# Altium project A3010_IDE.PrjPcb
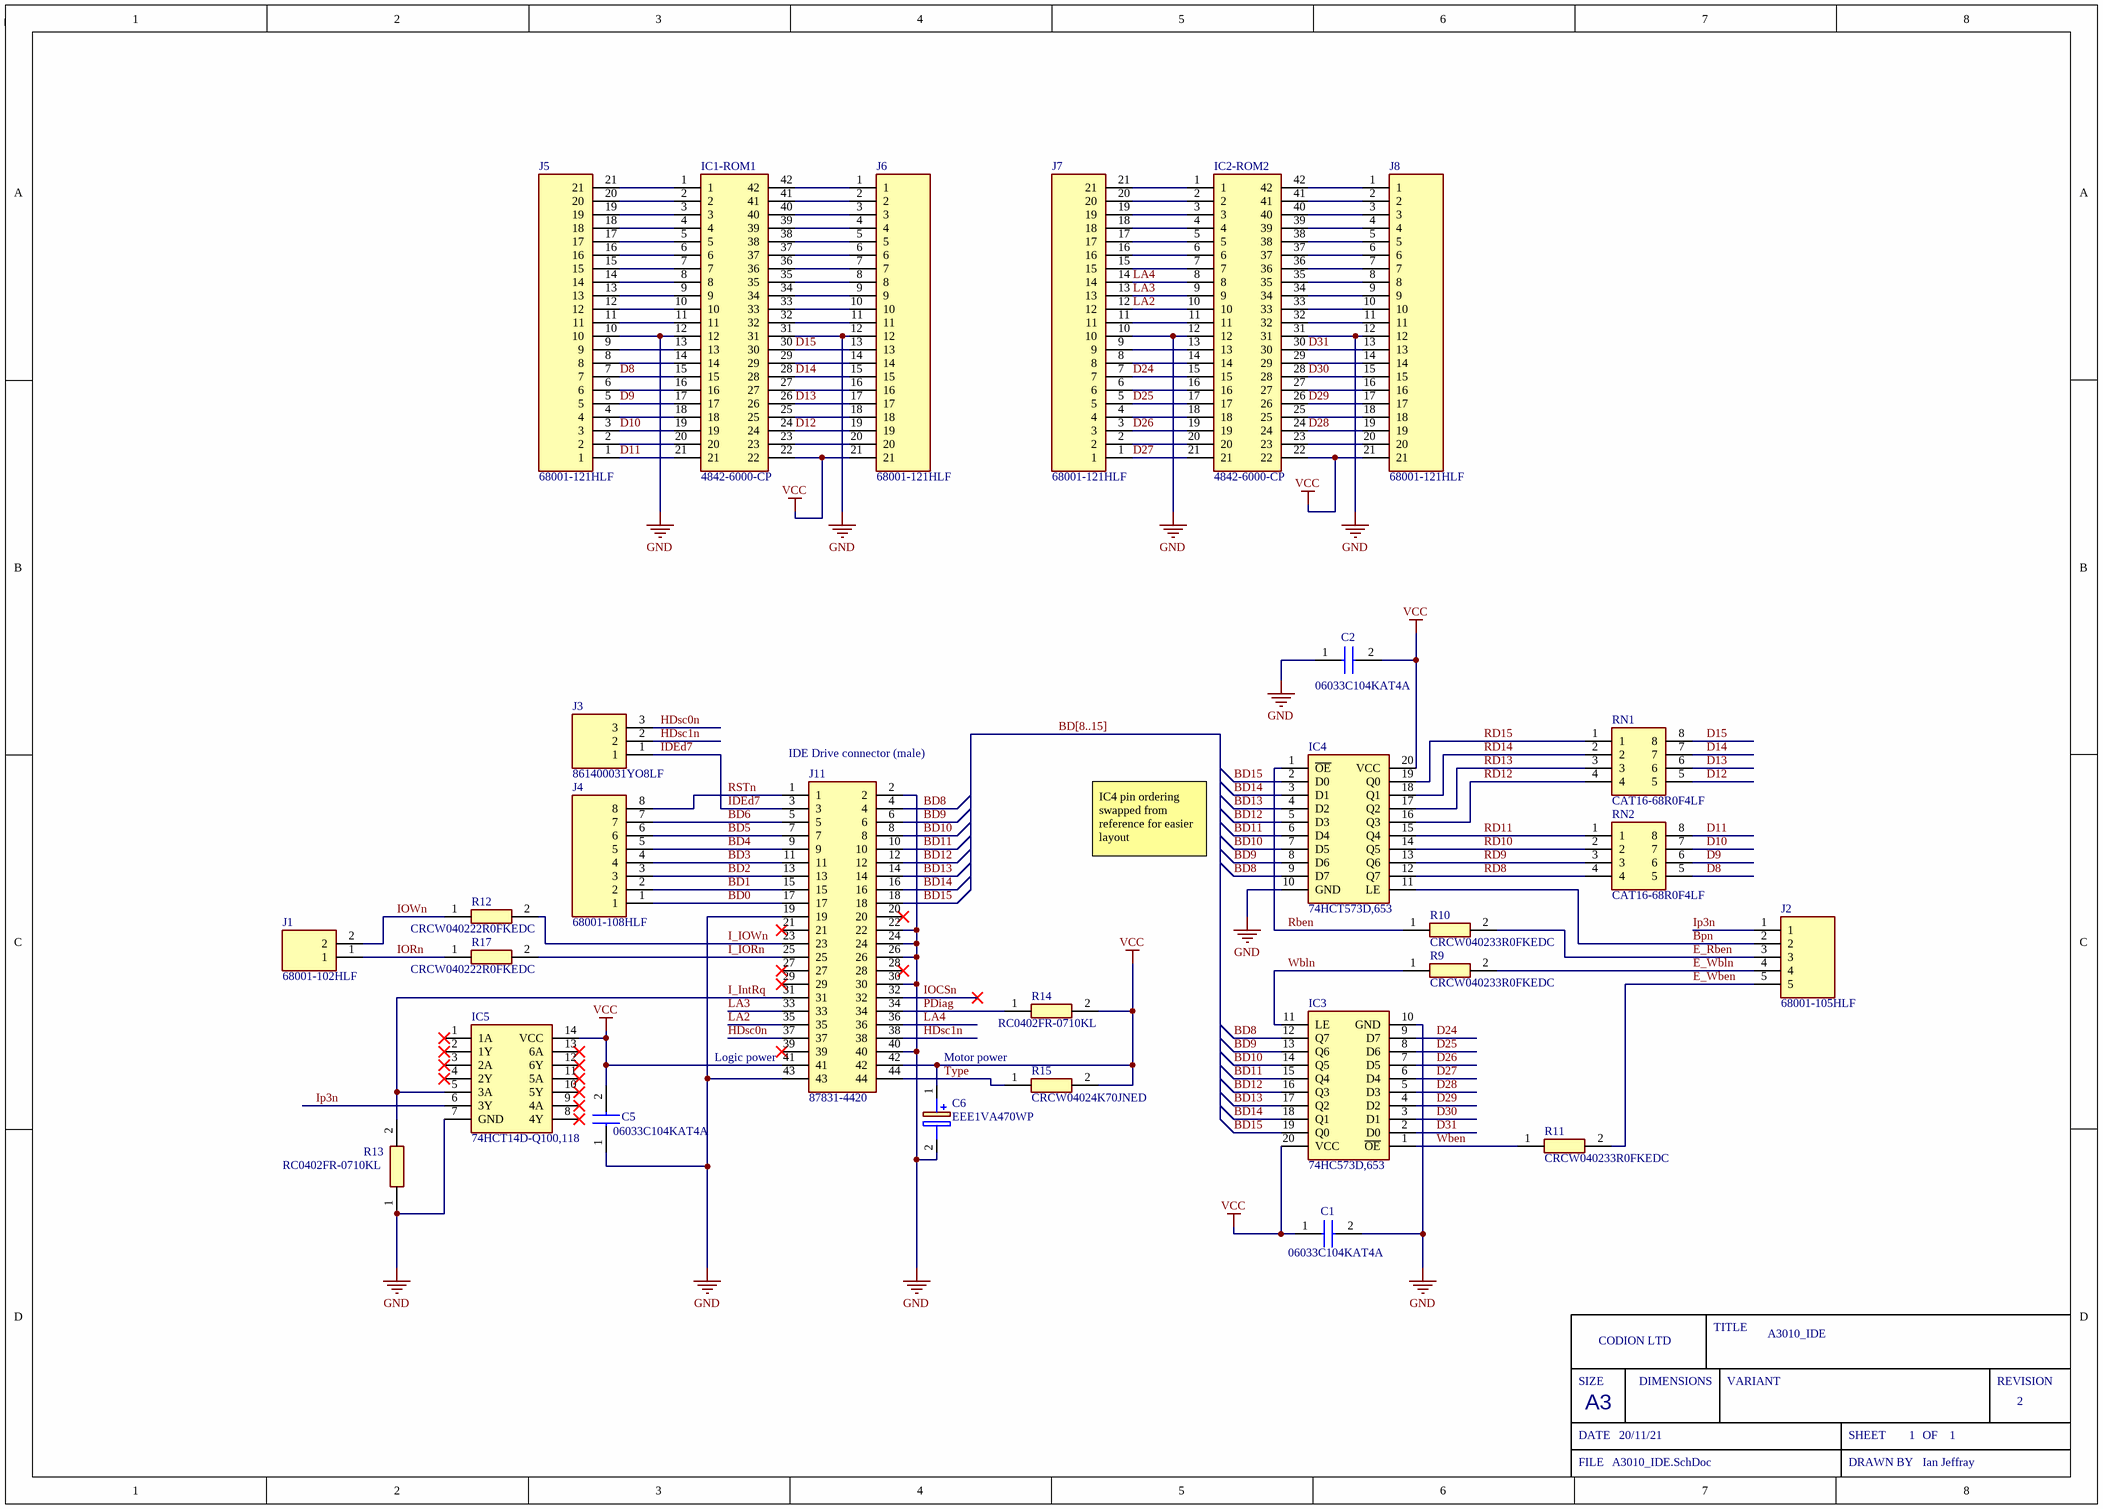
[diagram p0: A3010_IDE.SchDoc]
Sch_RevNo: 2; Sch_ReleaseDate: 20/11/21; Project_TItle: A3010_IDE
1 sheet, 28 parts. Net scope: global (net labels, ports and power ports of the same name join across sheets).
Board file: A3010_IDE.PcbDoc

## Sheet A3010_IDE.SchDoc
size A3; SheetNumber: 1; SheetTotal: 1

### Parts
C1  06033C104KAT4A  [CAPC1608X90N]
C2  06033C104KAT4A  [CAPC1608X90N]
C5  06033C104KAT4A  [CAPC1608X90N]
C6  EEE1VA470WP  [EEE1AA101SP]
IC1-ROM1  4842-6000-CP  [48426000CP]
IC2-ROM2  4842-6000-CP  [48426000CP]
IC3  74HC573D,653  [SOIC127P1032X265-20N]
IC4  74HCT573D,653  [SOIC127P1032X265-20N]
IC5  74HCT14D-Q100,118  [SOIC127P600X175-14N]
J1  68001-102HLF  [HDRV2W67P0X254_1X2_508X241X858P]
J2  68001-105HLF  [HDRV5W90P0X254_1X5_1270X241X1143P]
J3  861400031YO8LF  [HDRV3W63P0X254_1X3_762X254X980P]
J4  68001-108HLF  [HDRV8W90P0X254_1X8_2032X241X1143P]
J5  68001-121HLF  [HDRV21W67P0X254_1X21_5334X241X858P]
J6  68001-121HLF  [HDRV21W67P0X254_1X21_5334X241X858P]
J7  68001-121HLF  [HDRV21W67P0X254_1X21_5334X241X858P]
J8  68001-121HLF  [HDRV21W67P0X254_1X21_5334X241X858P]
J11  87831-4420  [SHDR44W55P200_2X22_4665X630X640P]
R9  CRCW040233R0FKEDC  [RESC1005X35N]
R10  CRCW040233R0FKEDC  [RESC1005X35N]
R11  CRCW040233R0FKEDC  [RESC1005X35N]
R12  CRCW040222R0FKEDC  [RESC1005X35N]
R13  RC0402FR-0710KL  [RESC1005X40N]
R14  RC0402FR-0710KL  [RESC1005X40N]
R15  CRCW04024K70JNED  [RESC1005X40N]
R17  CRCW040222R0FKEDC  [RESC1005X35N]
RN1  CAT16-68R0F4LF  [CAT1668R0F4LF]
RN2  CAT16-68R0F4LF  [CAT1668R0F4LF]

### Nets
GND: C1.2 C2.1 C5.1 C6.2(-) IC1-ROM1.12 IC1-ROM1.31 IC2-ROM2.12 IC2-ROM2.31 IC3.10(GND) IC4.10(GND) IC5.7(GND) J5.10 J6.12 J7.10 J8.12 J11.2 J11.19 J11.22 J11.24 J11.26 J11.30 J11.40 J11.43 R13.1
VCC: C1.1 C2.2 C5.2 C6.1(+) IC1-ROM1.22 IC2-ROM2.22 IC3.20(VCC) IC4.20(VCC) IC5.14(VCC) J6.21 J8.21 J11.41 J11.42 R14.2 R15.2
BD0: J4.1 J11.17
BD1: J4.2 J11.15
BD2: J4.3 J11.13
BD3: J4.4 J11.11
BD4: J4.5 J11.9
BD5: J4.6 J11.7
BD6: J4.7 J11.5
BD8: IC3.12(Q7) IC4.9(D7) J11.4
BD9: IC3.13(Q6) IC4.8(D6) J11.6
BD10: IC3.14(Q5) IC4.7(D5) J11.8
BD11: IC3.15(Q4) IC4.6(D4) J11.10
BD12: IC3.16(Q3) IC4.5(D3) J11.12
BD13: IC3.17(Q2) IC4.4(D2) J11.14
BD14: IC3.18(Q1) IC4.3(D1) J11.16
BD15: IC3.19(Q0) IC4.2(D0) J11.18
Bpn: IC4.11(LE) J2.2
D8: IC1-ROM1.15 J5.7 RN2.5
D9: IC1-ROM1.17 J5.5 RN2.6
D10: IC1-ROM1.19 J5.3 RN2.7
D11: IC1-ROM1.21 J5.1 RN2.8
D12: IC1-ROM1.24 J6.19 RN1.5
D13: IC1-ROM1.26 J6.17 RN1.6
D14: IC1-ROM1.28 J6.15 RN1.7
D15: IC1-ROM1.30 J6.13 RN1.8
D24: IC2-ROM2.15 IC3.9(D7) J7.7
D25: IC2-ROM2.17 IC3.8(D6) J7.5
D26: IC2-ROM2.19 IC3.7(D5) J7.3
D27: IC2-ROM2.21 IC3.6(D4) J7.1
D28: IC2-ROM2.24 IC3.5(D3) J8.19
D29: IC2-ROM2.26 IC3.4(D2) J8.17
D30: IC2-ROM2.28 IC3.3(D1) J8.15
D31: IC2-ROM2.30 IC3.2(D0) J8.13
E_Rben: J2.3 R10.2
E_Wben: J2.5 R11.2
E_Wbln: J2.4 R9.2
HDsc0n: J3.3 J11.37
HDsc1n: J3.2 J11.38
I_IntRq: IC5.5(3A) J11.31 R13.2
I_IORn: J11.25 R17.2
I_IOWn: J11.23 R12.2
IDEd7: J3.1 J11.3
IOCSn: J11.32
IORn: J1.1 R17.1
IOWn: J1.2 R12.1
Ip3n: IC5.6(3Y) J2.1
LA2: IC2-ROM2.10 J7.12 J11.35
LA3: IC2-ROM2.9 J7.13 J11.33
LA4: IC2-ROM2.8 J7.14 J11.36
PDiag: J11.34 R14.1
Rben: IC4.1(~{OE}) R10.1
RD8: IC4.12(Q7) RN2.4
RD9: IC4.13(Q6) RN2.3
RD10: IC4.14(Q5) RN2.2
RD11: IC4.15(Q4) RN2.1
RD12: IC4.16(Q3) RN1.4
RD13: IC4.17(Q2) RN1.3
RD14: IC4.18(Q1) RN1.2
RD15: IC4.19(Q0) RN1.1
RSTn: J4.8 J11.1
Type: J11.44 R15.1
Wben: IC3.1(~{OE}) R11.1
Wbln: IC3.11(LE) R9.1
NetIC1-ROM1_1: IC1-ROM1.1 J5.21
NetIC1-ROM1_2: IC1-ROM1.2 J5.20
NetIC1-ROM1_3: IC1-ROM1.3 J5.19
NetIC1-ROM1_4: IC1-ROM1.4 J5.18
NetIC1-ROM1_5: IC1-ROM1.5 J5.17
NetIC1-ROM1_6: IC1-ROM1.6 J5.16
NetIC1-ROM1_7: IC1-ROM1.7 J5.15
NetIC1-ROM1_8: IC1-ROM1.8 J5.14
NetIC1-ROM1_9: IC1-ROM1.9 J5.13
NetIC1-ROM1_10: IC1-ROM1.10 J5.12
NetIC1-ROM1_11: IC1-ROM1.11 J5.11
NetIC1-ROM1_13: IC1-ROM1.13 J5.9
NetIC1-ROM1_14: IC1-ROM1.14 J5.8
NetIC1-ROM1_16: IC1-ROM1.16 J5.6
NetIC1-ROM1_18: IC1-ROM1.18 J5.4
NetIC1-ROM1_20: IC1-ROM1.20 J5.2
NetIC1-ROM1_23: IC1-ROM1.23 J6.20
NetIC1-ROM1_25: IC1-ROM1.25 J6.18
NetIC1-ROM1_27: IC1-ROM1.27 J6.16
NetIC1-ROM1_29: IC1-ROM1.29 J6.14
NetIC1-ROM1_32: IC1-ROM1.32 J6.11
NetIC1-ROM1_33: IC1-ROM1.33 J6.10
NetIC1-ROM1_34: IC1-ROM1.34 J6.9
NetIC1-ROM1_35: IC1-ROM1.35 J6.8
NetIC1-ROM1_36: IC1-ROM1.36 J6.7
NetIC1-ROM1_37: IC1-ROM1.37 J6.6
NetIC1-ROM1_38: IC1-ROM1.38 J6.5
NetIC1-ROM1_39: IC1-ROM1.39 J6.4
NetIC1-ROM1_40: IC1-ROM1.40 J6.3
NetIC1-ROM1_41: IC1-ROM1.41 J6.2
NetIC1-ROM1_42: IC1-ROM1.42 J6.1
NetIC2-ROM2_1: IC2-ROM2.1 J7.21
NetIC2-ROM2_2: IC2-ROM2.2 J7.20
NetIC2-ROM2_3: IC2-ROM2.3 J7.19
NetIC2-ROM2_4: IC2-ROM2.4 J7.18
NetIC2-ROM2_5: IC2-ROM2.5 J7.17
NetIC2-ROM2_6: IC2-ROM2.6 J7.16
NetIC2-ROM2_7: IC2-ROM2.7 J7.15
NetIC2-ROM2_11: IC2-ROM2.11 J7.11
NetIC2-ROM2_13: IC2-ROM2.13 J7.9
NetIC2-ROM2_14: IC2-ROM2.14 J7.8
NetIC2-ROM2_16: IC2-ROM2.16 J7.6
NetIC2-ROM2_18: IC2-ROM2.18 J7.4
NetIC2-ROM2_20: IC2-ROM2.20 J7.2
NetIC2-ROM2_23: IC2-ROM2.23 J8.20
NetIC2-ROM2_25: IC2-ROM2.25 J8.18
NetIC2-ROM2_27: IC2-ROM2.27 J8.16
NetIC2-ROM2_29: IC2-ROM2.29 J8.14
NetIC2-ROM2_32: IC2-ROM2.32 J8.11
NetIC2-ROM2_33: IC2-ROM2.33 J8.10
NetIC2-ROM2_34: IC2-ROM2.34 J8.9
NetIC2-ROM2_35: IC2-ROM2.35 J8.8
NetIC2-ROM2_36: IC2-ROM2.36 J8.7
NetIC2-ROM2_37: IC2-ROM2.37 J8.6
NetIC2-ROM2_38: IC2-ROM2.38 J8.5
NetIC2-ROM2_39: IC2-ROM2.39 J8.4
NetIC2-ROM2_40: IC2-ROM2.40 J8.3
NetIC2-ROM2_41: IC2-ROM2.41 J8.2
NetIC2-ROM2_42: IC2-ROM2.42 J8.1

Not connected (* = marked no-connect by the designer): IC5 1(1A)* 2(1Y)* 3(2A)* 4(2Y)* 8(4Y)* 9(4A)* 10(5Y)* 11(5A)* 12(6Y)* 13(6A)*; J11 20* 21* 27* 28* 29* 39*

### Buses and harness runs
bus BD[8..15]

### Notes on the sheet
- (near J11) IDE Drive connector (male)
- IC4 pin ordering swapped from reference for easier layout
- (near J11) Logic power
- Motor power
- Ian Jeffray
- SIZE
- CODION LTD
- DIMENSIONS
- TITLE
- VARIANT
- REVISION
- DATE
- A3
- SHEET
- OF
- FILE
- DRAWN BY

### Library data of the parts
C1 C2 C5 = 06033C104KAT4A: Capacitor; Manufacturer_Name: AVX; Datasheet Link: http://www.mouser.com/catalog/supplier/library/pdf/AVXSurfaceMountCeramic.pdf; Height: 0.9mm; Manufacturer_Part_Number: 06033C104KAT4A; Mouser Part Number: 581-06033C104KAT4A; Mouser Price/Stock: https://www.mouser.co.uk/ProductDetail/AVX/06033C104KAT4A?qs=8C2chATdSPiv3E9zfPZulg%3D%3D; Arrow Part Number: 06033C104KAT4A; Arrow Price/Stock: https://www.arrow.com/en/products/06033c104kat4a/avx?region=nac
C6 = EEE1VA470WP: Capacitor Polarised; Manufacturer_Name: Panasonic; Datasheet Link: http://industrial.panasonic.com/cdbs/www-data/pdf/RDE0000/ABA0000C1145.pdf; Height: 7.8mm; Manufacturer_Part_Number: EEE1VA470WP
IC1-ROM1 IC2-ROM2 = 4842-6000-CP: Connector; Manufacturer_Name: 3M; Datasheet Link: https://componentsearchengine.com/Datasheets/1/4842-6000-CP.pdf; Height: 5.334mm; Manufacturer_Part_Number: 4842-6000-CP; Mouser Part Number: 517-4842-6000-CP; Mouser Price/Stock: https://www.mouser.com/Search/Refine.aspx?Keyword=517-4842-6000-CP
IC3 = 74HC573D,653: Integrated Circuit; Manufacturer_Name: Nexperia; Datasheet Link: https://assets.nexperia.com/documents/data-sheet/74HC_HCT573.pdf; Height: 2.65mm; Manufacturer_Part_Number: 74HC573D,653; Mouser Part Number: 771-74HC573D-T; Mouser Price/Stock: https://www.mouser.co.uk/ProductDetail/Nexperia/74HC573D653?qs=P62ublwmbi8WfKX2wZR8SA%3D%3D; Arrow Part Number: 74HC573D,653; Arrow Price/Stock: https://www.arrow.com/en/products/74hc573d653/nexperia?region=asia
IC4 = 74HCT573D,653: Integrated Circuit; Manufacturer_Name: Nexperia; Datasheet Link: https://assets.nexperia.com/documents/data-sheet/74HC_HCT573.pdf; Height: 2.65mm; Manufacturer_Part_Number: 74HCT573D,653; Mouser Part Number: 771-HCT573D653; Mouser Price/Stock: https://www.mouser.co.uk/ProductDetail/Nexperia/74HCT573D653?qs=me8TqzrmIYW0cewPmm%252By%2Fg%3D%3D; Arrow Part Number: 74HCT573D,653; Arrow Price/Stock: https://www.arrow.com/en/products/74hct573d653/nexperia
IC5 = 74HCT14D-Q100,118: Integrated Circuit; Manufacturer_Name: Nexperia; Datasheet Link: https://assets.nexperia.com/documents/data-sheet/74HC_HCT14_Q100.pdf; Height: 1.75mm; Manufacturer_Part_Number: 74HCT14D-Q100,118; Mouser Part Number: 771-74HCT14D-Q100118; Mouser Price/Stock: https://www.mouser.com/Search/Refine.aspx?Keyword=771-74HCT14D-Q100118; Arrow Part Number: 74HCT14D-Q100,118; Arrow Price/Stock: https://www.arrow.com/en/products/74hct14d-q100118/nexperia?region=nac
J1 = 68001-102HLF: Connector; Manufacturer_Name: Amphenol; Datasheet Link: https://cdn.amphenol-icc.com/media/wysiwyg/files/drawing/68000.pdf; Height: 8.58mm; Manufacturer_Part_Number: 68001-102HLF; Mouser Part Number: 649-68001-102HLF; Mouser Price/Stock: https://www.mouser.co.uk/ProductDetail/Amphenol-FCI/68001-102HLF/?qs=U4OZ2mbKj8feu9tJlaXIaQ%3D%3D; Arrow Part Number: 68001-102HLF; Arrow Price/Stock: https://www.arrow.com/en/products/68001-102hlf/amphenol-fci
J2 = 68001-105HLF: Connector; Manufacturer_Name: Amphenol; Datasheet Link: https://datasheet.datasheetarchive.com/originals/distributors/Datasheets_SAMA/c5633c0073cf34d35a9dcd840869dfda.pdf; Height: 11.43mm; Manufacturer_Part_Number: 68001-105HLF; Mouser Part Number: 649-68001-105HLF; Mouser Price/Stock: https://www.mouser.com/Search/Refine.aspx?Keyword=649-68001-105HLF; Arrow Part Number: 68001-105HLF; Arrow Price/Stock: https://www.arrow.com/en/products/68001-105hlf/amphenol-fci
J3 = 861400031YO8LF: Connector; Manufacturer_Name: Amphenol; Datasheet Link: https://cdn.amphenol-icc.com/media/wysiwyg/files/drawing/c-8614-0089.pdf; Height: 9.8mm; Manufacturer_Part_Number: 861400031YO8LF; Mouser Part Number: 649-861400031YO8LF; Mouser Price/Stock: https://www.mouser.com/Search/Refine.aspx?Keyword=649-861400031YO8LF; Arrow Part Number: 861400031YO8LF; Arrow Price/Stock: https://www.arrow.com/en/products/861400031yo8lf/amphenol-fci
J4 = 68001-108HLF: Connector; Manufacturer_Name: Amphenol; Datasheet Link: https://datasheet.datasheetarchive.com/originals/distributors/Datasheets_SAMA/c5633c0073cf34d35a9dcd840869dfda.pdf; Height: 11.43mm; Manufacturer_Part_Number: 68001-108HLF; Mouser Part Number: 649-68001-108HLF; Mouser Price/Stock: https://www.mouser.co.uk/ProductDetail/Amphenol-FCI/68001-108HLF?qs=QKvFUfBIyQKXzKR4Fn7cFQ%3D%3D; Arrow Part Number: 68001-108HLF; Arrow Price/Stock: https://www.arrow.com/en/products/68001-108hlf/amphenol-fci?region=nac
J5-J8 = 68001-121HLF: Connector; Manufacturer_Name: Amphenol; Datasheet Link: https://datasheet.datasheetarchive.com/originals/distributors/Datasheets_SAMA/c5633c0073cf34d35a9dcd840869dfda.pdf; Height: 8.58mm; Manufacturer_Part_Number: 68001-121HLF; Mouser Part Number: 649-68001-121HLF; Mouser Price/Stock: https://www.mouser.co.uk/ProductDetail/Amphenol-FCI/68001-121HLF/?qs=QKvFUfBIyQK%252BoxmWjqVzjQ%3D%3D; Arrow Part Number: 68001-121HLF; Arrow Price/Stock: https://www.arrow.com/en/products/68001-121hlf/amphenol-fci?region=nac
J11 = 87831-4420: Connector; Manufacturer_Name: Molex; Datasheet Link: https://datasheet.datasheetarchive.com/originals/distributors/Datasheets-DGA22/2095109.pdf; Height: 6.4mm; Manufacturer_Part_Number: 87831-4420; Mouser Part Number: 538-87831-4420; Mouser Price/Stock: https://www.mouser.co.uk/ProductDetail/Molex/87831-4420?qs=tYx%252BZc2nXqqGnHzye8Wn9w%3D%3D
R9-R11 = CRCW040233R0FKEDC: Resistor; Manufacturer_Name: Vishay; Datasheet Link: http://www.vishay.com/docs/28773/crcwce3.pdf; Height: 0.35mm; Manufacturer_Part_Number: CRCW040233R0FKEDC; Mouser Part Number: 71-CRCW040233R0FKEDC; Mouser Price/Stock: https://www.mouser.co.uk/ProductDetail/Vishay-Dale/CRCW040233R0FKEDC?qs=E3Y5ESvWgWMDHctUwHh1hg%3D%3D; Arrow Part Number: CRCW040233R0FKEDC; Arrow Price/Stock: https://www.arrow.com/en/products/crcw040233r0fkedc/vishay?region=nac
R12 R17 = CRCW040222R0FKEDC: Resistor; Manufacturer_Name: Vishay; Datasheet Link: http://www.vishay.com/docs/28773/crcwce3.pdf; Height: 0.35mm; Manufacturer_Part_Number: CRCW040222R0FKEDC; Mouser Part Number: 71-CRCW040222R0FKEDC; Mouser Price/Stock: https://www.mouser.co.uk/ProductDetail/Vishay-Dale/CRCW040222R0FKEDC?qs=E3Y5ESvWgWOcWdklyAJ7%252BQ%3D%3D; Arrow Part Number: CRCW040222R0FKEDC; Arrow Price/Stock: https://www.arrow.com/en/products/crcw040222r0fkedc/vishay?region=nac
R13 R14 = RC0402FR-0710KL: Resistor; Manufacturer_Name: YAGEO (PHYCOMP); Datasheet Link: https://datasheet.datasheetarchive.com/originals/distributors/Datasheets_SAMA/902f9e387b938f871d31120f5fc1d65e.pdf; Height: 0.4mm; Manufacturer_Part_Number: RC0402FR-0710KL; Mouser Part Number: 603-RC0402FR-0710KL; Mouser Price/Stock: https://www.mouser.co.uk/ProductDetail/YAGEO/RC0402FR-0710KL?qs=I1mnnYJTTsxUoNwrUsQExA%3D%3D; Arrow Part Number: RC0402FR-0710KL; Arrow Price/Stock: https://www.arrow.com/en/products/rc0402fr-0710kl/yageo
R15 = CRCW04024K70JNED: Resistor; Manufacturer_Name: Vishay; Datasheet Link: http://www.vishay.com/docs/20035/dcrcwe3.pdf; Height: 0.4mm; Manufacturer_Part_Number: CRCW04024K70JNED; Mouser Part Number: 71-CRCW0402J-4.7K-E3; Mouser Price/Stock: https://www.mouser.co.uk/ProductDetail/Vishay-Dale/CRCW04024K70JNED?qs=iWCWVRvNViwY%252BotGHUbALg%3D%3D; Arrow Part Number: CRCW04024K70JNED; Arrow Price/Stock: https://www.arrow.com/en/products/crcw04024k70jned/vishay
RN1 RN2 = CAT16-68R0F4LF: Resistor Network; Manufacturer_Name: Bourns; Datasheet Link: https://www.mouser.com/datasheet/2/54/CATCAY-777361.pdf; Height: 0.6mm; Manufacturer_Part_Number: CAT16-68R0F4LF; Mouser Part Number: 652-CAT16-68R0F4LF; Mouser Price/Stock: https://www.mouser.co.uk/ProductDetail/Bourns/CAT16-68R0F4LF?qs=2cU%252Bdy8NdRpfh4EnG7Hj3A%3D%3D

## Assembly variants
STD: not fitted J1 J2 J3 J4